# Altium schematic sheet Precharge.SchDoc
size A
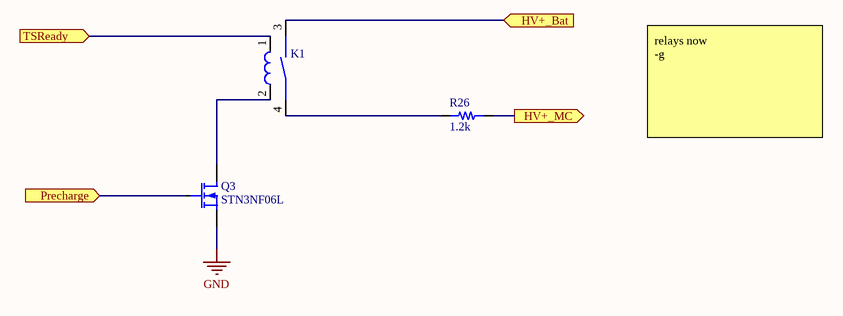
[diagram p0: Precharge.SchDoc]

## Parts
K1  LI24-1A85  [LI24-1A85]  (value not drawn)
Q3  STN3NF06L  [STN3NF06L]
R26  value 1.2k  [AP101]  (hidden comment: Resistor 1k2 100W 1% Throughhole)

## Ports
HV+_Bat (in), HV+_MC (out), Precharge (in), TSReady (in)

## Nets
GND: Q3.3(S)
HV+_Bat: K1.3 ; port HV+_Bat
HV+_MC: R26.2 ; port HV+_MC
Precharge: Q3.1(G) ; port Precharge
TSReady: K1.1 ; port TSReady
NetK1_2: K1.2 Q3.2(D)
NetK1_4: K1.4 R26.1

## Notes on the sheet
- relays now
  -g

## Library data of the parts
K1 = 3: RELAY REED SPST 1A 24V; id: 3; current: 1; voltage: 12; name: LI24-1A85; type: Reed; quantity: 0; link: https://www.digikey.com/product-detail/en/standex-meder-electronics/LI24-1A85/374-1296-ND/2208755; createdby: gray
Q3 = 8: MOSFET N-CH 60V 4A SOT223; id: 8; type: N_Channel; vdsmax: 0; numcircuits: 1; rdson: 70m; name: STN3NF06L; current: 4A; vgsmax: 0; package: SOT-233; quantity: 0; link: https://www.digikey.com/product-detail/en/stmicroelectronics/STN3NF06L/497-3177-1-ND/654516
R26 = 2705: 100W Throughhole Resistor; Manufacturer_id: 1; idResistor: 2705; Name: AP101 1K2 J; Tolerance: 5%; Created_By: Graydon; Supplier 1: Digi-Key; Supplier Part Number 1: AP1011K2J-ND; Drawer_id: 1; Power: 100W; Package: TO-247-2; MfrPartNo: AP101 1K2 J; Link: https://www.digikey.com/short/jvdcjz; ComponentLink1Description: Datasheet; ComponentLink1URL: https://www.ohmite.com/assets/docs/acl_ap101.pdf?r=false; Created_Date: 2018-11-24